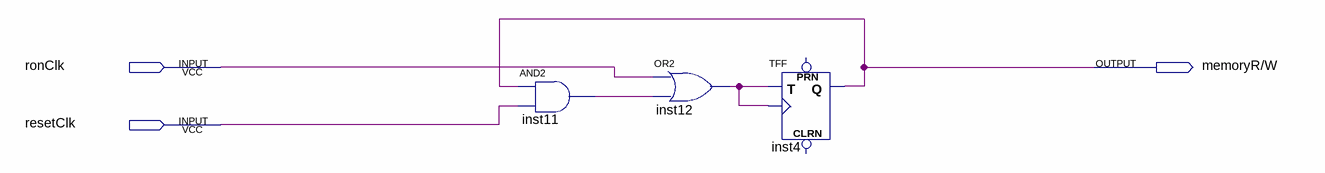
[diagram p0: schematic sheet]
// Quartus schematic memoryControl.bdf as structural Verilog: 3 symbols, 3 pins
module memoryControl (
  input  ronClk,
  input  resetClk,
  output \memoryR/W 
);

  wire inst11_out, inst12_out;

  and inst11 (inst11_out, \memoryR/W , resetClk);
  or inst12 (inst12_out, ronClk, inst11_out);
  TFF inst4 (.T(inst12_out), .CLK(inst12_out), .Q(\memoryR/W ));  // open: PRN, CLRN
endmodule
